# EAGLE design LeoStick (EAGLE 5.10)
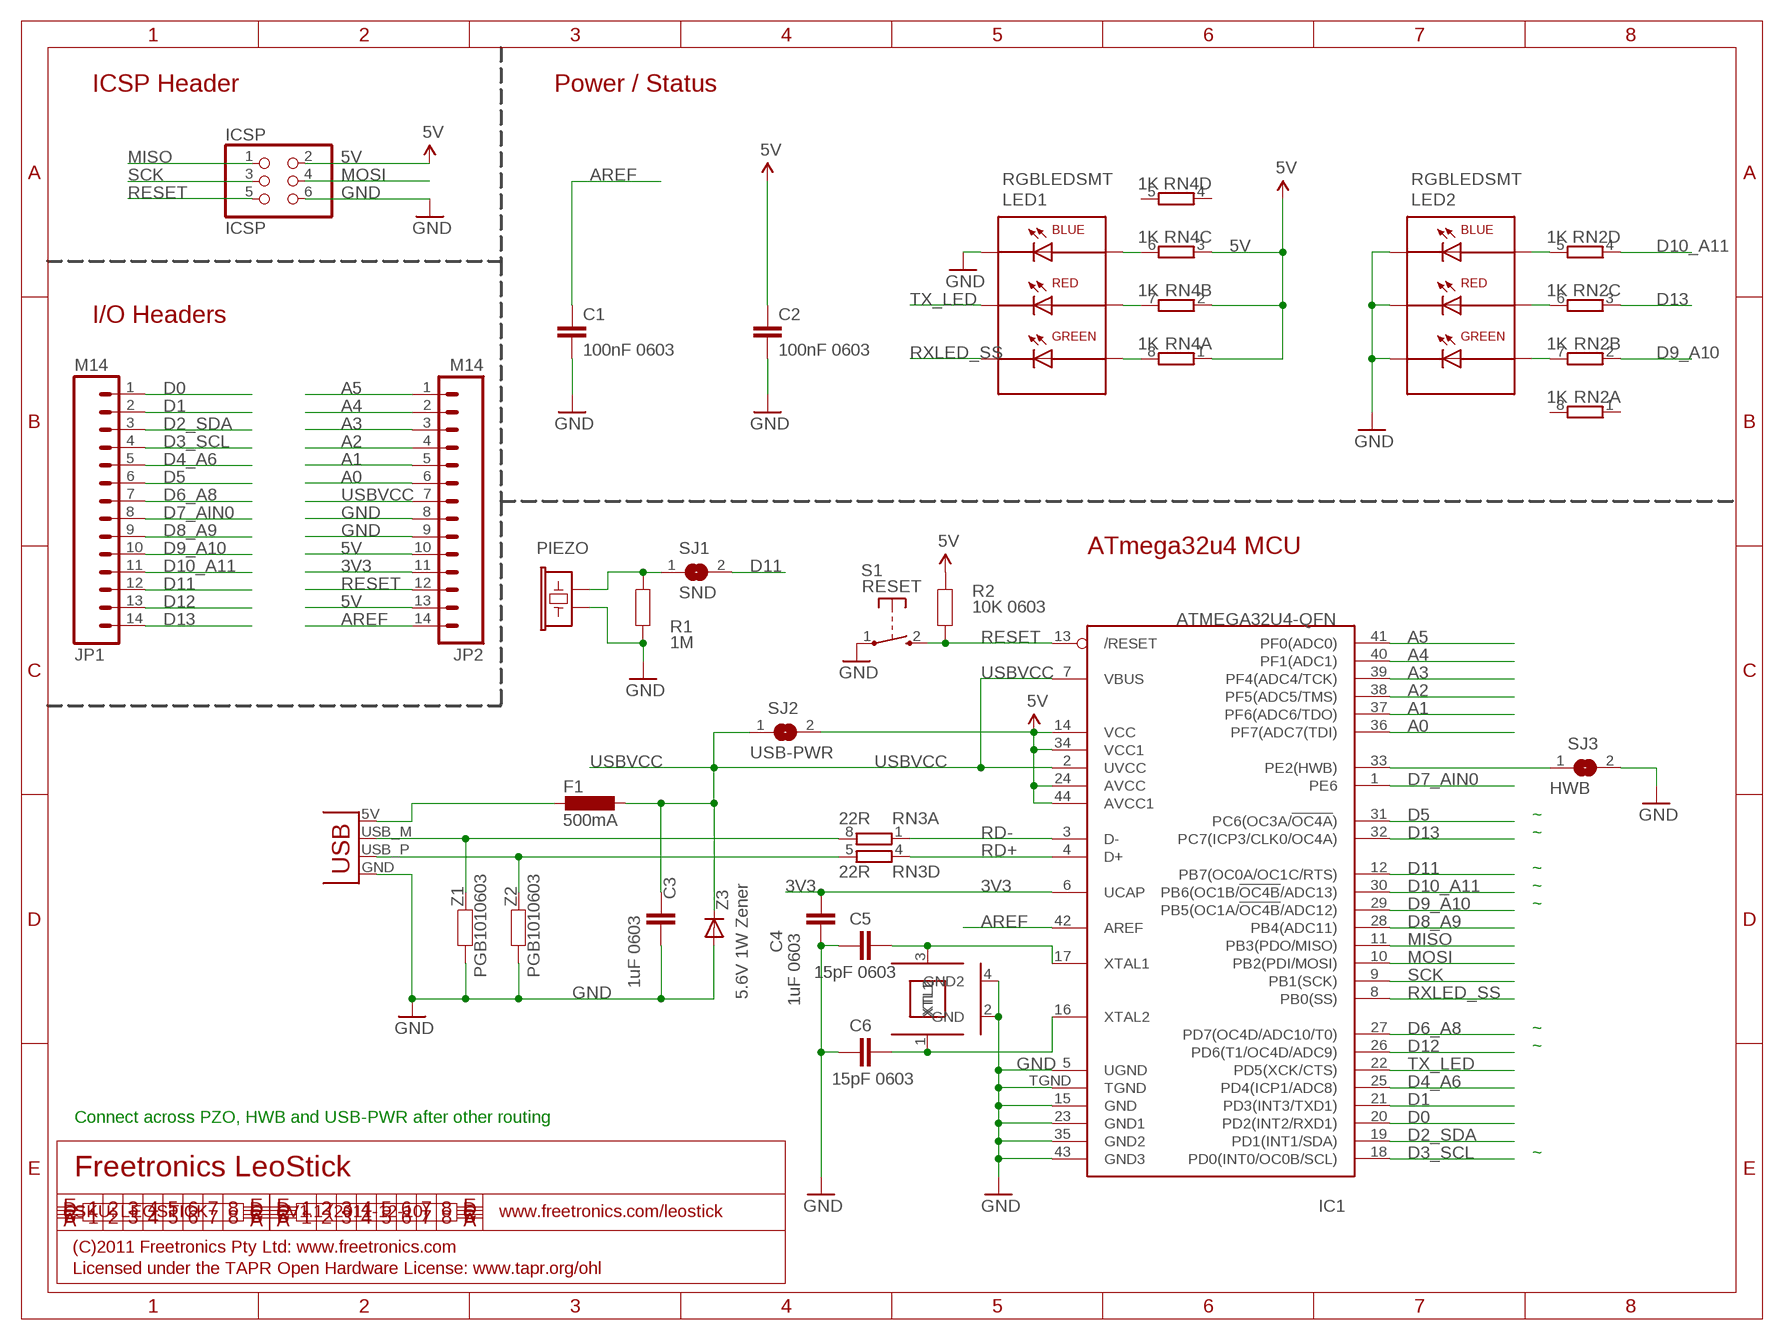
[diagram p0: schematic, sheet 1]

## Parts
C1  100nF 0603  CAP0603  [0603]
C2  100nF 0603  CAP0603  [0603]
C3  1uF 0603  CAP0603  [0603]
C4  1uF 0603  CAP0603  [0603]
C5  15pF 0603  CAP0603  [0603]
C6  15pF 0603  CAP0603  [0603]
F1  500mA  L-EUL1812  [L1812]
IC1  ATMEGA32U4-QFN  [QFN-44N]
ICSP  ICSP  PINHD-2X3  [2X03]
JP1  M14  [1X14]
JP2  M14  [1X14]
LED1  RGBLEDSMT  [19-337]
LED2  RGBLEDSMT  [19-337]
P1  USBPCB  [USB-A-PCB]
PIEZO  BUZZERSMD12X12  [BUZZER-12X12-SMT]
R1  1M  RESISTOR0603  [0603]
R2  10K 0603  RESISTOR0603  [0603]
RN2  1K  4R-NCAY16  [CAY16]
RN3  22R  4R-NCAY16  [CAY16]
RN4  1K  4R-NCAY16  [CAY16]
S1  RESET  TAC_SWITCH_2PIN  [TACTILE_SWITCH_SMD_2PIN_TINY]
SJ1  SND  SJ  [SJ]
SJ2  USB-PWR  SJ  [SJ]
SJ3  HWB  SJTINY  [SJ-TINY]
XTL1  16MHz  CRYSTAL-GND3X2  [CRYSTAL-SMD-3X2]
Z1  PGB1010603  RESISTOR0603  [0603]
Z2  PGB1010603  RESISTOR0603  [0603]
Z3  5.6V 1W Zener  DIODESMA  [SMA-DIODE]

## Nets
3V3: C4.2 IC1.6(UCAP) JP2.11
5V: C2.1 IC1.14(VCC) IC1.24(AVCC) IC1.34(VCC1) IC1.44(AVCC1) ICSP.2 JP2.10 JP2.13 R2.2 RN4.1 RN4.2 RN4.3 SJ2.2
A0: IC1.36(PF7(ADC7(TDI)) JP2.6
A1: IC1.37(PF6(ADC6/TDO)) JP2.5
A2: IC1.38(PF5(ADC5/TMS)) JP2.4
A3: IC1.39(PF4(ADC4/TCK)) JP2.3
A4: IC1.40(PF1(ADC1)) JP2.2
A5: IC1.41(PF0(ADC0)) JP2.1
AREF: C1.1 IC1.42(AREF) JP2.14
BLUE: LED2.4(A-B) RN2.5
D0: IC1.20(PD2(INT2/RXD1)) JP1.1
D1: IC1.21(PD3(INT3/TXD1)) JP1.2
D2_SDA: IC1.19(PD1(INT1/SDA)) JP1.3
D3_SCL: IC1.18(PD0(INT0/OC0B/SCL)) JP1.4
D4_A6: IC1.25(PD4(ICP1/ADC8)) JP1.5
D5: IC1.31(PC6(OC3A/!OC4A!)) JP1.6
D6_A8: IC1.27(PD7(OC4D/ADC10/T0)) JP1.7
D7_AIN0: IC1.1(PE6) JP1.8
D8_A9: IC1.28(PB4(ADC11)) JP1.9
D9_A10: IC1.29(PB5(OC1A/!OC4B!/ADC12)) JP1.10 RN2.2
D10_A11: IC1.30(PB6(OC1B/!OC4B!/ADC13)) JP1.11 RN2.4
D11: IC1.12(PB7(OC0A/OC1C/RTS)) JP1.12 SJ1.2
D12: IC1.26(PD6(T1/OC4D/ADC9)) JP1.13
D13: IC1.32(PC7(ICP3/CLK0/OC4A)) JP1.14 RN2.3
D+: P1.USB_P(D+) RN3.5 Z2.2
D-: P1.USB_M(D-) RN3.8 Z1.2
GND: C1.2 C2.2 C3.2 C4.1 C5.1 C6.1 IC1.5(UGND) IC1.15(GND) IC1.23(GND1) IC1.35(GND2) IC1.43(GND3) IC1.TGND ICSP.6 JP2.8 JP2.9 LED1.1(C-B) LED2.1(C-B) LED2.2(C-R) LED2.3(C-G) P1.GND PIEZO.1 R1.1 S1.1(P) SJ3.2 XTL1.2(GND) XTL1.4(GND2) Z1.1 Z2.1 Z3.A
GREEN: LED2.6(A-G) RN2.7
MISO: IC1.11(PB3(PDO/MISO)) ICSP.1
MOSI: IC1.10(PB2(PDI/MOSI)) ICSP.4
N$1: PIEZO.2 R1.2 SJ1.1
N$2: F1.2 P1.5V(VBUS)
N$3: IC1.33(PE2(HWB)) SJ3.1
N$11: C5.2 IC1.17(XTAL1) XTL1.3(XTL2)
N$12: C6.2 IC1.16(XTAL2) XTL1.1(XTL1)
N$14: LED1.4(A-B) RN4.6
N$16: LED1.5(A-R) RN4.7
N$17: LED1.6(A-G) RN4.8
RD+: IC1.4(D+) RN3.4
RD-: IC1.3(D-) RN3.1
RED: LED2.5(A-R) RN2.6
RESET: IC1.13(/RESET) ICSP.5 JP2.12 R2.1 S1.2(S)
RXLED_SS: IC1.8(PB0(SS)) LED1.3(C-G)
SCK: IC1.9(PB1(SCK)) ICSP.3
TX_LED: IC1.22(PD5(XCK/CTS)) LED1.2(C-R)
USBVCC: C3.1 F1.1 IC1.2(UVCC) IC1.7(VBUS) JP2.7 SJ2.1 Z3.C
Unconnected: RN2.1 RN2.8 RN3.2 RN3.3 RN3.6 RN3.7 RN4.4 RN4.5

## Notes on the sheet
- ICSP Header | Power / Status
- I/O Headers
- ATmega32u4 MCU
- ~
- ~
- ~
- ~
- ~
- ~
- ~
- Connect across PZO, HWB and USB-PWR after other routing
- ~
- Freetronics LeoStick
- SKU: LEOSTICK | V1.1 (2011-12-10) | www.freetronics.com/leostick
- (C)2011 Freetronics Pty Ltd: www.freetronics.com
- Licensed under the TAPR Open Hardware License: www.tapr.org/ohl

## Library data of the parts
C1-C6 = freetronics-master-v1.1:CAP: Capacitor Standard 0603 ceramic capacitor, and 0.1" leaded capacitor.
F1 = rcl:L-EU: INDUCTOR, European symbol
IC1 = freetronics-jon:ATMEGA32U4: ATMEGA32U4
ICSP = pinhead:PINHD-2X3: PIN HEADER
JP1 JP2 = freetronics-jon:M14: Header 14 Standard 14-pin 0.1" header. Use with straight break away headers (SKU : PRT-00116), right angle break away headers (PRT-00553), swiss pins (PRT-00743), machine pins (PRT-00117), and female headers (PRT-00115).
LED1 LED2 = freetronics-master-v1:RGBLED
P1 = freetronics-master-v1:USB: USB Connectors USB-B-PTH is fully proven SKU : PRT-00139 USB-miniB is fully proven SKU : PRT-00587 USB-A-PCB is untested. USB-A-H is throughly reviewed, but untested. Spark Fun Electronics SKU : PRT-00437 USB-B-SMT is throughly reviewed, but untested. Needs silkscreen touching up. USB-A-S has not been used/tested USB-MB-H has not been used/tested
PIEZO = freetronics-master-v1:BUZZER: Buzzer - Piezo Transducer
R1 = freetronics-master-v1:RESISTOR: Resistor Basic schematic elements and footprints for 0603, 1206, and PTH 1/10th watt (small) resistors.
R2 Z1 Z2 = freetronics-master-v1.1:RESISTOR: Resistor Basic schematic elements and footprints for 0603, 1206, and PTH 1/10th watt (small) resistors.
RN2-RN4 = resistor-dil:4R-N: Array Chip Resistor Source: RS Component / Phycomp
S1 = freetronics-master-v1:TAC_SWITCH_2PIN: Momentary Tactile Switch - 2 pin
SJ1 SJ2 = jumper:SJ: SMD solder JUMPER
SJ3 = freetronics-master-v1:SJ: SMD solder JUMPER
XTL1 = freetronics-jon:CRYSTAL-GND
Z3 = freetronics-master-v1:DIODE: Diode These are standard reverse protection diodes and small signal diodes. SMA package can handle up to about 1A. SOD-323 can handle about 200mA. What the SOD-323 package when ordering, there are some mfgs out there that are 5-pin packages.

## Net classes
0 default: width 0.152 mm, drill 0.241 mm, clearance 0.152 mm

## Board
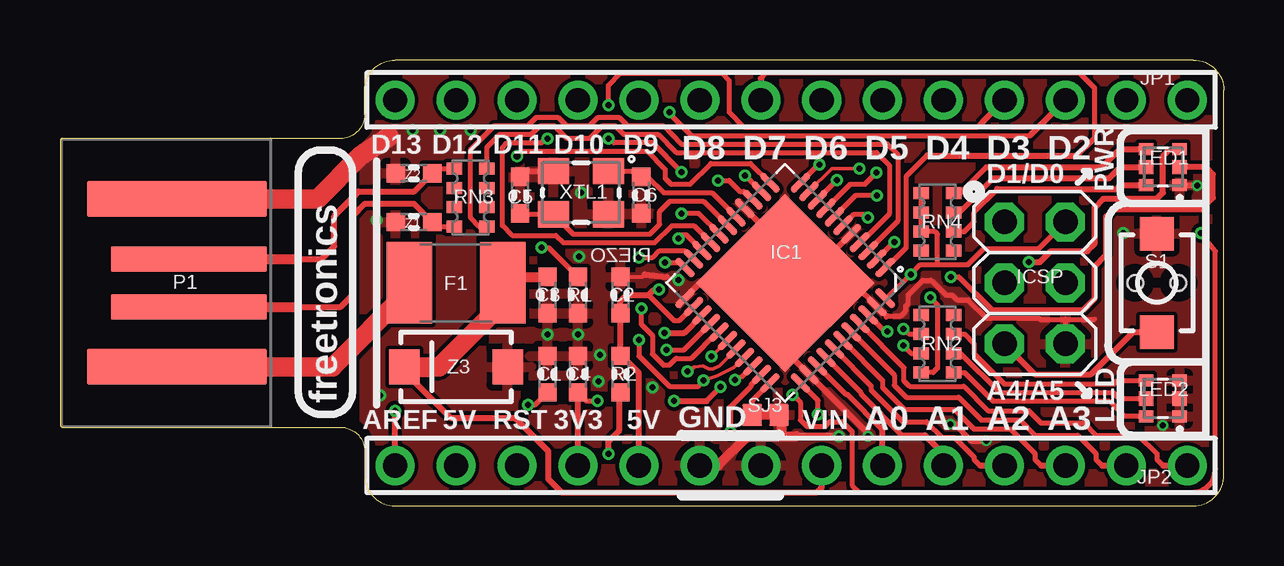
[diagram p1: board, top side]
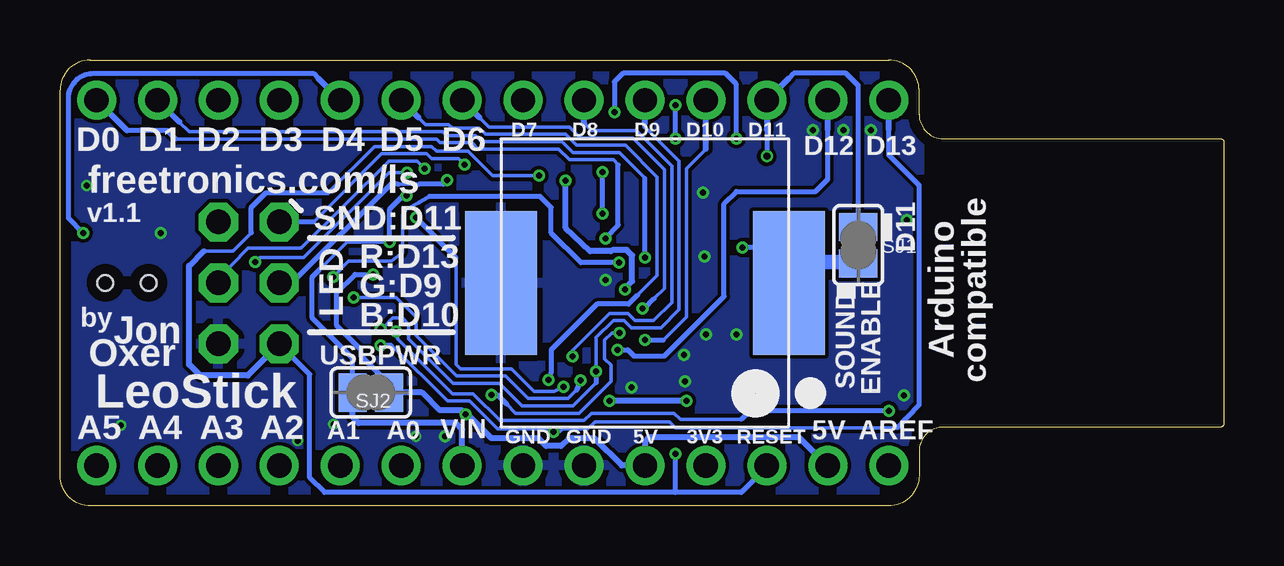
[diagram p2: board, bottom side, seen from below]

Size 48.51 x 18.59 mm. Coordinates in mm from the lower left corner, seen from the top.
Outline: 13.97,0 47.24,0 arc90 48.51,1.27 48.51,17.32 arc90 47.24,18.59 13.97,18.59 arc90 12.7,17.32 12.7,16.32 arc-90 11.7,15.32 0.15,15.32 arc90 0,15.16 0,3.43 arc90 0.15,3.28 11.7,3.28 arc-90 12.7,2.28 12.7,1.27 arc90 13.97,0
Copper layers (1*16): Top 0.035mm / dielectric 1.5mm / Bottom 0.035mm
Design rules "default *": minimum track width 6mil, minimum drill 9.5mil, track to track 6mil, track to pad 6mil, pad to pad 6mil, via to via 6mil, smd to smd 6mil, copper to edge 18mil, drill to drill 8mil, minimum pad ring 12mil, minimum via ring 4mil, stop-mask expansion 2mil, vias tented up to drill 25mil, thermal gap 10mil

### Footprints (pad centres in the part's own frame; a part is rotated, then mirrored left to right if it is on the bottom)
0603 = smd 0.762 x 0.762: 1 -0.762,0; 2 0.762,0
L1812 = smd 1.9 x 3.4: 1 -1.95,0; 2 1.95,0
QFN-44N = smd 0.3 x 1.05: 1 -2.5,-3.4; 2 -2,-3.4; 3 -1.5,-3.4; 4 -1,-3.4; 5 -0.5,-3.4; 6 0,-3.4; 7 0.5,-3.4; 8 1,-3.4; 9 1.5,-3.4; 10 2,-3.4; 11 2.5,-3.4; 23 2.5,3.4; 24 2,3.4; 25 1.5,3.4; 26 1,3.4; 27 0.5,3.4; 28 0,3.4; 29 -0.5,3.4; 30 -1,3.4; 31 -1.5,3.4; 32 -2,3.4; 33 -2.5,3.4 | smd 1.05 x 0.3: 12 3.4,-2.5; 13 3.4,-2; 14 3.4,-1.5; 15 3.4,-1; 16 3.4,-0.5; 17 3.4,0; 18 3.4,0.5; 19 3.4,1; 20 3.4,1.5; 21 3.4,2; 22 3.4,2.5; 34 -3.4,2.5; 35 -3.4,2; 36 -3.4,1.5; 37 -3.4,1; 38 -3.4,0.5; 39 -3.4,0; 40 -3.4,-0.5; 41 -3.4,-1; 42 -3.4,-1.5; 43 -3.4,-2; 44 -3.4,-2.5 | smd 5.25 x 5.25: TGND 0,0
2X03 = drill 1.016 octagon: 1 -2.54,-1.27; 2 -2.54,1.27; 3 0,-1.27; 4 0,1.27; 5 2.54,-1.27; 6 2.54,1.27
1X14 = drill 1.016 round: 1 0,0; 2 2.54,0; 3 5.08,0; 4 7.62,0; 5 10.16,0; 6 12.7,0; 7 15.24,0; 8 17.78,0; 9 20.32,0; 10 22.86,0; 11 25.4,0; 12 27.94,0; 13 30.48,0; 14 33.02,0
19-337 = smd 0.6 x 0.5: 1 -0.7,0.75; 3 -0.7,-0.75; 4 0.7,0.75; 6 0.7,-0.75 | smd 0.6 x 0.6: 2 -0.7,0; 5 0.7,0
USB-A-PCB = smd 7.5 x 1.5: 5V -0.2,-3.5; GND -0.2,3.5 | smd 6.5 x 1.067: USB_M 0.3,-1; USB_P 0.3,1
BUZZER-12X12-SMT = smd 3 x 6: 1 -6,0; 2 6,0
CAY16 = smd 0.5 x 0.65: 1 -1.2,-0.675; 2 -0.4,-0.675; 3 0.4,-0.675; 4 1.2,-0.675; 5 1.2,0.675; 6 0.4,0.675; 7 -0.4,0.675; 8 -1.2,0.675
TACTILE_SWITCH_SMD_2PIN_TINY = smd 1.4 x 1.4: 1 -2.05,0; 2 2.05,0 | hole 0.65: 0,0.9; 0,-0.9
SJ = smd 1.168 x 1.6: 1 -0.762,0; 2 0.762,0
SJ-TINY = smd 0.813 x 0.914: 1 -0.559,0; 2 0.559,0
CRYSTAL-SMD-3X2 = smd 1.3 x 1.1: 1 -1.15,-0.9; 2 1.15,-0.9; 3 1.15,0.9; 4 -1.15,0.9
SMA-DIODE = smd 1.27 x 1.47: A -2.15,0; C 2.15,0

### Placement (x,y rotation side)
C1  20.32,5.49 90 top
C2  23.37,8.79 90 top
C3  20.32,8.79 270 top
C4  21.59,5.49 270 top
C5  19.18,12.95 270 top
C6  24.23,12.95 90 top
F1  16.51,9.3 180 top
IC1  30.23,9.3 135 top
ICSP  40.64,9.3 270 top
JP1  46.99,16.92 180 top
JP2  46.99,1.68 180 top
LED1  45.97,14.12 180 top
LED2  45.97,4.47 180 top
P1  5.08,9.3 0 top
PIEZO  24.13,9.3 0 bottom
R1  21.59,8.79 90 top
R2  23.37,5.49 90 top
RN2  36.58,6.76 270 top
RN3  17.12,12.85 90 top
RN4  36.58,11.84 270 top
S1  45.72,9.3 270 top
SJ1  15.24,10.87 90 bottom
SJ2  35.56,4.72 0 bottom
SJ3  29.41,3.78 0 top
XTL1  21.72,13.06 180 top
Z1  14.76,11.84 0 top
Z2  14.76,13.87 0 top
Z3  16.51,5.79 180 top

### Tracks (layer width: path | path; a pad name or v marks a point on that pad's centre or on a via)
3V3  (via drill 0.25 pad 0.5)
  Top 0.203: v33.68,12.01 33.53,12.14 33.07,12.14 IC1.6 | 26.95,4.37 v27.53,4.95 | v22.4,4.37 21.95,4.37 C4.2
  Top 0.254: JP2.11 C4.2 | v25.6,4.37 26.95,4.37
  Bottom 0.152: 32,10.34 32,5.89 31.83,5.71 29.69,5.71 28.75,4.78 27.91,4.78 v27.53,4.95
  Bottom 0.203: 32,10.34 v33.68,12.01
  Bottom 0.254: v22.4,4.37 v25.6,4.37
5V  (via drill 0.25 pad 0.5)
  Top 0.152: 23.42,6.25 R2.2 | 28.84,12.76 IC1.14
  Top 0.203: RN4.1 RN4.2 RN4.3 36.47,11.44 36.58,11.33 36.58,10.06 | ICSP.2 40.79,10.72 38.51,10.72 37.85,10.06 36.58,10.06 | IC1.24 25.82,7.72 25.6,7.72 24.54,8.79 | v31.6,3.81 31.6,4.39 IC1.34 | 28.84,12.76 28.5,13.11 28.35,13.11 27.89,13.56 v27.43,13.56 | IC1.44 34.47,8.66 v35.46,9.65 35.87,10.06 36.58,10.06
  Top 0.254: R2.2 C2.1 23.37,8.53 23.62,8.79 24.54,8.79 24.74,8.99 v24.97,9.02 | 23.42,6.25 24.13,5.54 JP2.10
  Bottom 0.152: SJ2.2 34.8,5.08 | v24.97,9.02 24.97,9.07
  Bottom 0.203: SJ2.2 34.8,4.98 | 31.5,3.79 v31.6,3.81 | 34.8,5.08 35.97,6.25 35.97,6.5 36.98,7.52 36.98,8.89 36.22,9.65 v35.46,9.65
  Bottom 0.254: v31.6,3.81 31.77,3.99 32.69,3.99 33.43,4.72 SJ2.2 | 31.5,3.79 30.53,2.82 28.57,2.82 28.25,2.49 27.64,2.49 27.3,2.82 26.24,2.82 25.09,1.68 JP2.10 24.13,2.67 23.95,2.85 17.7,2.85 16.54,1.68 JP2.13 | v27.43,13.56 27.43,11.58 26.42,10.62 25.55,10.62 25.45,10.67 24.89,10.67 24.66,10.44 24.66,9.37 24.97,9.07
A0
  Top 0.203: IC1.36 32.77,4.63 32.83,4.63 34.29,3.17
  Top 0.254: JP2.6 34.29,3.17
A1
  Top 0.203: IC1.37 33.4,4.71 33.4,4.65 35.1,2.95 36.04,2.95
  Top 0.254: 36.04,2.95 36.83,2.16 JP2.5
A2
  Top 0.203: 38.35,1.68 38.1,1.93 38.1,2.03 37.29,2.85 36.78,2.85 36.12,3.5 35.13,3.5 33.81,4.83 33.81,5.01 IC1.38
  Top 0.254: 38.35,1.68 JP2.4
A3
  Top 0.203: 40.89,1.68 40.64,1.93 40.64,2.18 39.62,3.2 38.1,3.2 37.29,4.01 35.2,4.01 34.29,4.93 34.29,5.23 IC1.39
  Top 0.254: 40.89,1.68 JP2.3
A4
  Top 0.203: 43.43,1.68 43.18,1.93 43.18,2.18 42.42,2.95 40.64,2.95 40.01,3.58 38.41,3.58 37.47,4.52 35.28,4.52 34.77,5.03 34.77,5.46 IC1.40
  Top 0.254: 43.43,1.68 JP2.2
A5
  Top 0.203: 45.97,1.68 45.72,1.93 45.72,2.18 44.96,2.95 43.18,2.95 42.67,3.45 40.89,3.45 40.39,3.96 38.68,3.96 37.67,4.98 35.41,4.98 35.18,5.21 35.18,5.76 IC1.41
  Top 0.254: 45.97,1.68 JP2.1
AREF  (via drill 0.25 pad 0.5)
  Top 0.203: IC1.42 34.38,7.26 v34.49,7.26 | v19.51,4.22 19.81,4.22 C1.1
  Top 0.254: JP2.14 v13.97,3.96
  Bottom 0.152: 20.12,3.61 22.66,3.61 22.91,3.86 26.36,3.86 26.67,3.56 30.18,3.56 31.29,4.67 32.16,4.67 34.44,6.96 v34.49,7.26
  Bottom 0.203: 20.12,3.61 v19.51,4.22 19.48,4.22 19.23,3.96 v13.97,3.96
BLUE
  Top 0.152: 45.24,3.76 LED2.4
  Top 0.203: 45.24,3.76 44.35,3.76 43.74,4.37 38.89,4.37 37.7,5.56 RN2.5
D0  (via drill 0.25 pad 0.5)
  Top 0.203: IC1.20 26.1,11.3 25.93,11.3 v25.78,11.15
  Bottom 0.152: 25.25,14.22 25.45,14.43 27.28,14.43 27.74,14.88 31.09,14.88 31.34,15.14 32.66,15.14 32.82,15.29 43.69,15.29
  Bottom 0.203: 43.69,15.29 44.04,15.65 45.72,15.65 | v25.78,11.15 25.78,11.18 25.25,11.71 25.25,14.22
  Bottom 0.254: 45.72,15.65 JP1.1
D1  (via drill 0.25 pad 0.5)
  Top 0.203: IC1.21 26.05,10.64 24.99,10.64 24.71,10.36 v24.13,10.36
  Bottom 0.152: 24.13,13.66 25.2,14.73 27.13,14.73 27.58,15.19 30.94,15.19 31.19,15.44 32.41,15.44 32.56,15.6 43.13,15.6 43.54,16
  Bottom 0.203: v24.13,10.36 24.13,13.66
  Bottom 0.254: 43.54,16 JP1.2
D2_SDA  (via drill 0.25 pad 0.5)
  Top 0.203: 40.44,15.44 26.31,15.44 25.4,16.36 v25.4,16.41 | IC1.19 26.42,11.68 25.5,11.68 24.79,10.97 20.98,10.97 20.68,11.28 18.85,11.28 18.44,11.68 18.44,14.94 18.64,15.14 20.07,15.14 20.19,15.27 v20.32,15.32
  Top 0.254: 40.44,15.44 JP1.3
  Bottom 0.203: v25.4,16.41 25.4,17.68 25.04,18.03 20.78,18.03 20.32,17.58 v20.32,15.32
D3_SCL  (via drill 0.25 pad 0.5)
  Top 0.203: 38.46,16 38.25,15.8 28.5,15.8 27.89,16.41 27.89,17.73 27.58,18.03 23.37,18.03 22.86,17.53 v22.86,16.71 | v25.91,13.92 24.69,15.14 23.09,15.14 22.91,15.32 v22.86,15.32 | IC1.18 26.62,12.19 v25.91,12.19
  Top 0.254: 38.46,16 JP1.4
  Bottom 0.203: v25.91,12.19 v25.91,13.92 | v22.86,15.32 v22.86,16.71
D4_A6  (via drill 0.25 pad 0.5)
  Top 0.203: v47.55,11.38 48.16,10.62 48.16,1.52 arc-90 47.19,0.56 33.33,0.56 33.02,0.86 33.02,3.1 32.61,3.5 32.08,3.5 31.88,3.3 31.14,3.3 30.86,3.58 30.86,4.32 30.61,4.57 v30.53,4.62
  Top 0.254: v25.2,7.21 26.02,7.21 IC1.25
  Bottom 0.152: v25.2,7.21 25.5,7.21 25.81,6.91 25.81,6.12 25.55,5.87 25.55,5.18 26.87,3.86 29.52,3.86 29.9,4.24
  Bottom 0.203: 37.74,17.83 37.95,18.03 47.12,18.03 arc-90 48.16,16.99 48.16,11.99 v47.55,11.38 | v30.53,4.62 30.28,4.62 29.9,4.24
  Bottom 0.254: 37.74,17.83 JP1.5
D5  (via drill 0.25 pad 0.5)
  Top 0.203: IC1.31 28.44,5.38 v28.14,5.26
  Bottom 0.152: 24.43,8.79 23.62,9.6 23.62,13.72 24.94,15.04 26.98,15.04 27.43,15.49 30.79,15.49 31.04,15.75 32.16,15.75 32.31,15.9 33.27,15.9 33.58,16.2
  Bottom 0.203: v28.14,5.26 28.04,5.59 28.04,6.5 26.14,8.41 24.82,8.41 24.43,8.79
  Bottom 0.254: 33.58,16.2 JP1.6
D6_A8  (via drill 0.25 pad 0.5)
  Top 0.203: IC1.27 27.41,7.25 26.31,6.15 25.68,6.15 25.4,5.87 25.15,5.87 24.69,6.33 24.69,7.11 24.23,7.57 v24.23,8.23
  Bottom 0.152: 31.04,16.2 30.63,15.8 27.28,15.8 26.82,15.34 24.64,15.34 23.32,14.02 23.32,9.07 23.75,8.64
  Bottom 0.203: v24.23,8.23 24.16,8.23 23.75,8.64
  Bottom 0.254: 31.04,16.2 JP1.7
D7_AIN0
  Top 0.203: 34.49,10 IC1.1 34.44,9.93 35.28,10.77 35.28,13.74 36.14,14.61 | 43.13,15.34 43.13,17.42 42.52,18.03 29.41,18.03 29.21,17.83
  Top 0.254: 36.14,14.61 42.39,14.61 43.13,15.34 | 29.21,17.83 JP1.8
D8_A9  (via drill 0.25 pad 0.5)
  Top 0.152: IC1.28 v27.15,6.22
  Bottom 0.152: v27.15,6.22 27.28,6.35 25.6,8.03 24.84,8.03 24.54,7.72 23.77,7.72 23.01,8.48 23.01,14.17 24.49,15.65 26.36,15.65 26.67,15.95
  Bottom 0.254: 26.67,15.95 JP1.9
D9_A10  (via drill 0.25 pad 0.5)
  Top 0.152: IC1.29 27.48,5.84 27.23,5.71 27.05,5.71 26.8,5.84 26.44,5.79 v26.16,5.61
  Top 0.203: RN2.2 35.41,7.16 v35.15,7.37
  Bottom 0.152: v26.16,5.61 26.16,7.01 25.45,7.72 24.99,7.72 24.69,7.42 23.47,7.42 22.71,8.18 22.71,14.38 24.13,15.8 | v35.15,7.37 35,7.47 34.65,7.82 34.24,7.82 33.98,7.57 33.98,6.96 32.13,5.11 30.2,5.11 29.26,4.17 27.13,4.17 26.16,5.13
  Bottom 0.203: v26.16,5.61 26.16,5.13 | 24.13,15.8 24.13,15.95
  Bottom 0.254: 24.13,15.95 JP1.10
D10_A11  (via drill 0.25 pad 0.5)
  Top 0.152: v26.82,5.23 27.38,5.41 27.64,5.54 28.08,5.77 IC1.30
  Top 0.203: RN2.4 36.39,5.56 36.58,5.74 36.58,8.38 v36.27,8.69 | v24.13,6.91 24.13,6.25 25.4,4.98 26.62,4.98 v26.82,5.23
  Bottom 0.152: 23.37,6.91 22.4,7.87 22.4,14.07 21.59,14.88 | v36.27,8.69 34.49,8.69 33.68,7.87 33.68,7.11 31.98,5.41 29.95,5.41 29.01,4.47 27.33,4.47 26.98,4.83
  Bottom 0.203: v24.13,6.91 23.37,6.91 | v26.82,5.23 26.98,4.83
  Bottom 0.254: 21.59,14.88 JP1.11
D11  (via drill 0.3 pad 0.5)
  Top 0.203: IC1.12 28.78,14.28 27.13,14.28 26.26,13.41 25.48,13.41 25.22,13.66 25.22,14.02 24.46,14.78 19.3,14.78 v19.05,14.58
  Bottom 0.203: 19.05,15.7 v19.05,14.58 | SJ1.2 15.24,17.53 15.75,18.03 17.93,18.03 18.14,17.83
  Bottom 0.254: 19.05,15.7 JP1.12 18.14,17.83
D12  (via drill 0.25 pad 0.5)
  Top 0.203: v25.27,6.5 26.02,6.5 IC1.26
  Bottom 0.203: 16.51,15.7 16.51,13.61 17.02,13.11 20.32,13.11 20.83,12.6 20.83,8.74 23.32,6.25 24.59,6.25 24.84,6.5 v25.27,6.5
  Bottom 0.254: 16.51,15.7 JP1.13
D13  (via drill 0.25 pad 0.5)
  Top 0.152: 28.8,4.98 28.8,5.05
  Top 0.203: v35.15,6.68 35.48,6.36 RN2.3 | 27.94,4.12 28.8,4.98 | 28.8,5.05 IC1.32
  Top 0.254: v27.94,3.07 27.94,4.12
  Bottom 0.152: 34.7,6.68 32.36,4.37 31.45,4.37 30.28,3.2 28.22,3.2 | 13.61,3.25 22.86,3.25 23.11,3.5 26.21,3.5 26.52,3.2 27.64,3.2 | 27.74,3.1 v27.94,3.07 28.12,3.1
  Bottom 0.203: 13.61,3.25 12.7,4.22 12.7,13.36 13.97,14.63 13.97,15.7 | 27.64,3.2 27.74,3.1 | 28.12,3.1 28.22,3.2 | 34.7,6.68 v35.15,6.68
  Bottom 0.254: 13.97,15.7 JP1.14
D+
  Top 0.203: Z2.2 15.68,14.05 RN3.5
  Top 0.254: Z2.2 14.76,13.11 12.45,13.11 11.43,12.09 11.43,10.82 10.91,10.3 9.89,10.3
  Top 0.406: P1.USB_P 9.89,10.3
D-
  Top 0.203: Z1.2 15.68,11.65 RN3.8
  Top 0.254: Z1.2 14.76,12.6 12.7,12.6 12.19,12.09 12.19,8.79 11.7,8.3 9.92,8.3
  Top 0.406: P1.USB_M 9.92,8.3
GND  (via drill 0.25, 0.25 pad 0.5)
  Top 0.152: 25.3,9.55 v25.78,9.42 | 24.38,9.65 24.28,9.55 C2.2 | 33.15,9.27 33.11,9.24
  Top 0.203: C5.1 19.19,13.96 | 26.84,9.45 27.28,9.45 27.43,9.3 PIEZO.1 IC1.TGND | 41.91,7.77 40.84,7.77 40.79,7.82 38.61,7.82 37.85,8.59 37.39,8.59 37.19,8.79 36.93,8.79 36.32,9.4 35.97,9.4 35.36,8.79 35.36,8.43 35.26,8.33 35.26,8.13 35.05,7.92 34.49,7.92 34.44,7.87 34.44,7.91 IC1.43 | 41.91,7.77 43.13,7.77 | 41.91,7.77 ICSP.6 | 33.12,9.3 33.15,9.27 | 33.11,9.24
  Top 0.254: 30.23,6.47 IC1.35 33.68,3.01 v33.68,2.9 | 19.19,13.96 XTL1.2 | IC1.23 26.84,9.45 | 24.38,9.65 25.3,9.55 | 33.12,9.3 33.07,9.35 33.07,9.28 32.55,9.8 31.45,9.8 | IC1.15 29.46,11.48 29.46,9.96 PIEZO.1 | IC1.5 31.45,9.8 | 31.45,9.8 30.73,9.8 IC1.TGND 30.23,6.47 | 33.11,9.24 IC1.43 | 30.23,6.47 | v37.11,3.4 37.31,3.4 38,2.72 v38.61,2.72 | LED1.1 47.38,13.37 v47.4,13.36
  Top 0.305: 30.68,2.9 v32.46,2.9
  Top 0.406: 30.1,2.9 28.65,2.9 27.43,1.68 JP2.9 | 30.1,2.9 30.68,2.9 | SJ3.2 30.1,3.79 30.1,2.9
  Top 0.813: 13.72,15.39 12.51,14.59 10.74,12.8 P1.GND
  other vias: 13.21,11.91 20.32,7.14 14.71,15.67 24.69,4.93 44.32,11.38 21.59,7.14 21.72,13.06 21.64,10.39 22.45,5.18 22.5,6.3 13.34,4.6 17.12,15.67 15.85,15.67 45.97,3.35
  pour Bottom: 12.7,17.32 arc-74 13.97,18.59 47.24,18.59 arc-74 48.51,17.32 48.51,1.27 arc-74 47.24,0 13.97,0 arc-74 12.7,1.27
  pour Top: 12.7,17.32 arc-74 13.97,18.59 47.24,18.59 arc-74 48.51,17.32 48.51,1.27 arc-74 47.24,0 13.97,0 arc-74 12.7,1.27
GREEN
  Top 0.152: LED2.6 45.27,5.21
  Top 0.203: 45.24,5.23 LED2.6 44.08,5.22 43.94,5.08 39.37,5.08 38.1,6.35 38.1,6.76 37.7,7.16 RN2.7
MISO  (via drill 0.25 pad 0.5)
  Top 0.152: 31.5,14.1 v31.65,14.22
  Top 0.203: IC1.11 31.5,14.1
  Bottom 0.152: 37.95,11.84 35.1,14.68 33.22,14.68 33.02,14.48 31.9,14.48 v31.65,14.22
  Bottom 0.203: 37.95,11.84 ICSP.1
MOSI  (via drill 0.25 pad 0.5)
  Top 0.152: v33.33,14.07 32.17,14.07 IC1.10
  Bottom 0.152: 42.09,9.3 40.66,10.74 38.46,10.74 34.8,14.38 33.63,14.38 v33.33,14.07
  Bottom 0.203: 42.09,9.3 ICSP.4
N$1  (via drill 0.25 pad 0.5)
  Top 0.203: R1.2 20.37,10.77 v20.07,10.77
  Bottom 0.203: 18.13,11.73 18.13,10.16 PIEZO.2 18.8,10.77 v20.07,10.77
  Bottom 0.61: SJ1.1 15.29,10.16 18.13,10.16
N$2
  Top 0.406: 14.48,8.91 14.48,9.21 F1.2
  Top 0.813: 14.48,8.91 11.36,5.8 P1.5V
N$3
  Top 0.203: IC1.33 28.85,4.39 SJ3.1
N$4
  Top 0.406: 28.83,3.81 29.97,3.81
N$5
  Bottom 0.406: 15.24,11.56 15.24,10.16
N$11
  Top 0.152: 20.44,12.12 XTL1.3 20.51,12.21
  Top 0.203: C5.2 19.21,12.16 XTL1.3 | 20.51,12.21 21.39,11.33 24.59,11.33 24.99,11.73 24.99,12.27 25.43,12.7 26.82,12.7 IC1.17
N$12
  Top 0.203: XTL1.1 23.99,13.96 C6.2 24.51,13.72 25.17,13.06 27.17,13.06 IC1.16
N$14
  Top 0.203: 39.06,13.21 38.1,12.24 38.1,11.84 37.7,11.44 RN4.6
  Top 0.254: 39.06,13.21 44.04,13.21 44.21,13.37 LED1.4
N$16
  Top 0.203: 38.91,13.66 37.48,12.24 RN4.7
  Top 0.254: 38.91,13.66 43.74,13.66 44.2,14.12 LED1.5
N$17
  Top 0.203: LED1.6 44.86,14.88 | 38.61,14.12 37.52,13.04 RN4.8
  Top 0.254: 38.61,14.12 43.43,14.12 44.18,14.87 LED1.6
RD+
  Top 0.203: RN3.4 17.8,14.95 18.34,15.49 19.66,15.49 20.02,15.85 20.6,15.85 21.11,15.34 22.1,15.34 22.61,15.85 23.14,15.85 23.5,15.49 24.92,15.49 25.68,14.73 34.04,14.73 34.57,14.2 34.57,12.17 33.4,10.99 IC1.4
RD-
  Top 0.203: RN3.1 17.46,11.65 17.12,11.99 17.12,14.86 18.11,15.85 19.51,15.85 19.86,16.2 20.75,16.2 21.11,15.85 22.07,15.85 22.43,16.2 23.29,16.2 23.65,15.85 25.15,15.85 25.88,15.09 34.49,15.09 34.92,14.66 34.92,11.87 IC1.3
RED
  Top 0.152: LED2.5 44.4,4.47 | RN2.6 37.53,6.36
  Top 0.203: 37.53,6.36 39.17,4.72 43.89,4.72 44.15,4.47 LED2.5
RESET  (via drill 0.25 pad 0.5)
  Top 0.152: 23.32,4.67 R2.1
  Top 0.203: S1.2 45.7,7.26 | IC1.13 28.79,13.56 v28.55,13.77
  Top 0.254: 23.32,4.67 23.32,3.15 22.86,2.69 v22.86,2.16 | ICSP.5 40.64,5.49 42.98,5.49 44.74,7.25 S1.2
  Bottom 0.152: 42.52,10.62 41.3,10.62 40.54,11.38 | 37.34,13.06 35.41,14.99 33.02,14.99 32.82,14.78 31.5,14.78 30.48,13.77 v28.55,13.77 | JP2.12 19.05,1.63
  Bottom 0.203: 40.54,11.38 40.54,12.45 39.93,13.06 37.34,13.06 | 19.05,1.63 20.12,0.56 22.86,0.56 | 22.86,0.56 37.49,0.56 38.1,1.17 38.1,5.49 ICSP.5 | 22.86,0.56 v22.86,2.16
  Bottom 0.254: 42.52,10.62 43.13,10.01 43.13,5.89 42.67,5.44 40.69,5.44 ICSP.5
RXLED_SS  (via drill 0.25 pad 0.5)
  Top 0.152: IC1.8 32.02,12.49
  Top 0.203: 32.02,12.49 32.94,13.41 33.55,13.41 v34.04,13.89
  Top 0.254: v40.39,10.16 40.84,10.16 41.3,10.62 42.82,10.62 43.13,10.92 43.13,12.45 43.48,12.8 45.72,12.8 45.97,13.06 45.97,14.58 46.27,14.87 LED1.3
  Bottom 0.152: v34.04,13.89 34.8,13.89 38.35,10.36 40.18,10.36 v40.39,10.16
SCK  (via drill 0.25 pad 0.5)
  Top 0.152: 32.42,13.61 v32.38,13.59
  Top 0.203: IC1.9 32.42,13.61
  Bottom 0.152: 33.55,13.41 34.42,13.41
  Bottom 0.203: ICSP.3 38.86,9.3 34.72,13.41 34.42,13.41 | v32.38,13.59 32.54,13.41 33.55,13.41
TX_LED  (via drill 0.25 pad 0.5)
  Top 0.152: 25.9,10.06 IC1.22
  Top 0.203: v37.13,9.55 37.47,9.55 38.84,8.18 42.67,8.18 | v25.22,10.13 25.73,10.13 25.9,10.06
  Top 0.254: 42.67,8.18 43.13,8.64 43.13,10.01 43.61,10.49 43.61,12.06 43.92,12.37 47.57,12.37 48.06,12.85 48.06,13.82 47.75,14.12 LED1.2 46.58,14.12
  Bottom 0.152: v37.13,9.55 36.47,10.21 34.7,10.21 34.24,10.57 34.24,12.12 34.06,12.37 33.58,12.62 33.12,12.9
  Bottom 0.203: v25.22,10.13 26.8,10.13 28.04,11.38 28.04,12.45 28.5,12.9 33.12,12.9
USBVCC  (via drill 0.25 pad 0.5)
  Top 0.152: C3.1 18.14,9.55 17.98,9.4 17.98,7.87 15.85,5.74 15.54,5.59 15.39,5.44 14.17,5.44
  Top 0.203: F1.1 18.66,9.1 | 18.42,8.42 18.42,9.26 | 34.12,10.39 IC1.2 34.76,11 v34.77,11 | v34.06,12.93 33.15,12.93 IC1.7 | 14.66,5.28 14.66,5.5 Z3.C
  Top 0.254: JP2.7 31.75,0.76 31.55,0.56 20.9,0.56 20.34,1.12 20.34,2.29 18.97,3.66 16.28,3.66 14.66,5.28
  Top 0.406: 18.42,9.26 F1.1 18.97,9.55 C3.1
  Top 0.813: 18.42,8.42 15.8,5.79 Z3.C
  Bottom 0.152: v34.77,11 36.55,11 37.69,9.86
  Bottom 0.203: v34.77,11 34.77,12.37 34.19,12.95 v34.06,12.93 | 37.69,9.86 38,9.55 38,7.82 36.32,6.15 SJ2.1
  Bottom 0.254: SJ2.1 36.32,4.7 36.32,3.71 36.07,3.45 32.03,3.45 31.75,3.17 JP2.7
  Bottom 0.406: 36.32,4.7 34.8,4.7

### Text on the board
tPlace: D13 | D12 | D11 | D10 | D9 | D8 | D7 | D6 | D5 | D4 | D3 | D2 | D1/D0 | PWR | freetronics | A4/A5 | AREF | 5V | RST | 3V3 | 5V | GND | VIN | A0 | A1 | A2 | A3 | LED
bPlace: D13 | D12 | D11 | D10 | D9 | D8 | D7 | D6 | D5 | D4 | D3 | D2 | D1 | D0 | freetronics.com/ls | SND:D11 | v1.1 | D11 | LED | R:D13 | G:D9 | B:D10 | Jon | by | Arduino | USBPWR | Oxer | compatible | ENABLE | SOUND | LeoStick | AREF | 5V | RESET | 3V3 | 5V | GND | GND | VIN | A0 | A1 | A2 | A3 | A4 | A5
tNames: LED1 | PIEZO | IC1 | S1 | LED2